# EAGLE design Motor_Driver_Mike (EAGLE 7.2.0)
DATABASE: C:\EAGLE-7.2.0\ulp\bom-ex164
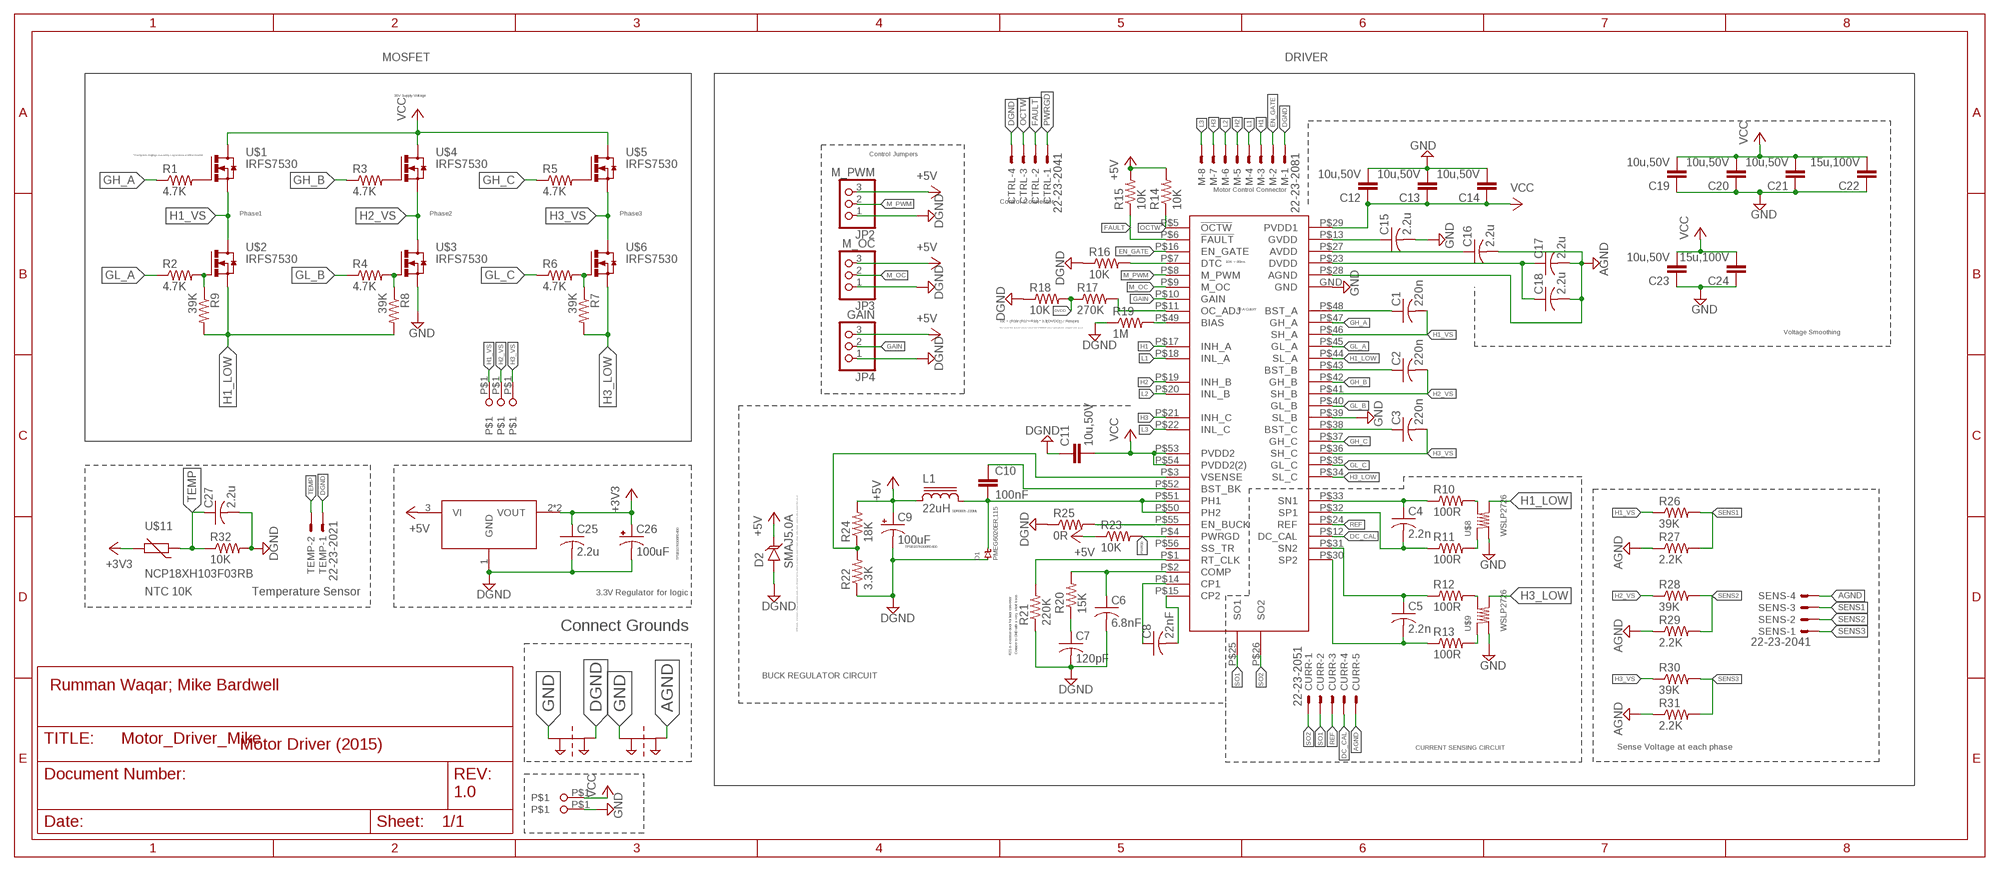
[diagram p0: schematic, sheet 1]

## Parts
C1  220n  C-USC0805  [C0805]
C2  220n  C-USC0805  [C0805]
C3  220n  C-USC0805  [C0805]
C4  2.2n  C-USC0603  [C0603]
C5  2.2n  C-USC0603  [C0603]
C6  6.8nF  C-USC0603  [C0603]
C7  120pF  C-USC0603  [C0603]
C8  22nF  C-USC0603  [C0603]
C9  100uF  CAP_POL3528-KIT  [EIA3528-KIT]
C10  100nF  CAP0805  [0805]
C11  10u,50V  CAP1206  [1206]
C12  10u,50V  CAP1206  [1206]
C13  10u,50V  CAP1206  [1206]
C14  10u,50V  CAP1206  [1206]
C15  2.2u  C-USC0805  [C0805]
C16  2.2u  C-USC0805  [C0805]
C17  2.2u  C-USC0805  [C0805]
C18  2.2u  C-USC0805  [C0805]
C19  10u,50V  CAP1206  [1206]
C20  10u,50V  CAP1206  [1206]
C21  10u,50V  CAP1206  [1206]
C22  15u,100V  C-EUC2220K  [C2220K]
C23  10u,50V  CAP1206  [1206]
C24  15u,100V  C-EUC2220K  [C2220K]
C25  2.2u  C-USC0805  [C0805]
C26  100uF  CAP_POL3528-KIT  [EIA3528-KIT]
C27  2.2u  C-USC0805  [C0805]
CTRL  22-23-2041  [22-23-2041]
CURR  22-23-2051  [22-23-2051]
D1  PMEG6020ER,115  DIODE[SCHOTKY]-SOD123W  [SOD123W]
D2  SMAJ5.0A  TVSSMA  [SMA-DIODE]
JP2  M_PWM  PINHD-1X3  [1X03]
JP3  M_OC  PINHD-1X3  [1X03]
JP4  GAIN  PINHD-1X3  [1X03]
L1  22uH  SDR0805  [SDR0805]
M  22-23-2081  [22-23-2081]
PT1  2PT_GND_TIE  [2PT_GND_TIE]
PT2  2PT_GND_TIE  [2PT_GND_TIE]
R1  4.7K  R-US_R0603  [R0603]
R2  4.7K  R-US_R0603  [R0603]
R3  4.7K  R-US_R0603  [R0603]
R4  4.7K  R-US_R0603  [R0603]
R5  4.7K  R-US_R0603  [R0603]
R6  4.7K  R-US_R0603  [R0603]
R7  39K  R-US_R0603  [R0603]
R8  39K  R-US_R0603  [R0603]
R9  39K  R-US_R0603  [R0603]
R10  100R  R-US_R0603  [R0603]
R11  100R  R-US_R0603  [R0603]
R12  100R  R-US_R0603  [R0603]
R13  100R  R-US_R0603  [R0603]
R14  10K  R-US_R0603  [R0603]
R15  10K  R-US_R0603  [R0603]
R16  10K  R-US_R0603  [R0603]
R17  270K  R-US_R0603  [R0603]
R18  10K  R-US_R0603  [R0603]
R19  1M  R-US_R0603  [R0603]
R20  15K  R-US_R0603  [R0603]
R21  220K  R-US_R0603  [R0603]
R22  3.3K  R-US_R0603  [R0603]
R23  10K  R-US_R0603  [R0603]
R24  18K  R-US_R0603  [R0603]
R25  0R  R-US_R0603  [R0603]
R26  39K  R-US_R0805  [R0805]
R27  2.2K  R-US_R0805  [R0805]
R28  39K  R-US_R0805  [R0805]
R29  2.2K  R-US_R0805  [R0805]
R30  39K  R-US_R0805  [R0805]
R31  2.2K  R-US_R0805  [R0805]
R32  10K  R-US_M0805  [M0805]
SENS  22-23-2041  [22-23-2041]
TEMP  22-23-2021  [22-23-2021]
U$1  IRFS7530  IRFS7530_HEATSINK  [IRF7530_HEATSINK]
U$2  IRFS7530  IRFS7530_HEATSINK  [IRF7530_HEATSINK]
U$3  IRFS7530  IRFS7530_HEATSINK  [IRF7530_HEATSINK]
U$4  IRFS7530  IRFS7530_HEATSINK  [IRF7530_HEATSINK]
U$5  IRFS7530  IRFS7530_HEATSINK  [IRF7530_HEATSINK]
U$6  IRFS7530  IRFS7530_HEATSINK  [IRF7530_HEATSINK]
U$7  DRV8302  [DRV8302]
U$8  WSLP2726  [WSLP2726]
U$9  WSLP2726  [WSLP2726]
U$10  TC2117  [SOT223]
U$11  NCP18XH103F03RB  [R0603]
U$12  1CONN_SOLDER  [1CONN_PAD]
U$13  1CONN_SOLDER  [1CONN_PAD]
U$14  1CONN_SOLDER  [1CONN_PAD]
U$15  1CONN_SOLDER  [1CONN_PAD]
U$16  1CONN_SOLDER  [1CONN_PAD]

## Nets
+3V3: C25.1 C26.A(+) U$10.2(VOUT) U$10.4(VOUT) U$11.2
+5V: C9.A(+) D2.C JP2.3 JP3.3 JP4.3 L1.1 R14.2 R15.2 R23.1 R24.2 U$10.3(VI)
AGND: C16.2 C17.2 C18.2 CURR.5 PT2.P$2 R27.1 R29.1 R31.1 SENS.4 U$7.P$28(AGND)
DC_CAL: CURR.4 U$7.P$12(DC_CAL)
DGND: C6.2 C7.2 C9.C(-) C11.1 C25.2 C26.C(-) C27.2 CTRL.4 D1.P$1 D2.A JP2.1 JP3.1 JP4.1 M.1 PT1.P$2 R16.1 R18.1 R19.1 R21.1 R22.1 R25.1 R32.2 TEMP.1 U$10.1(GND)
DVDD: R17.1 R18.2
EN_GATE: M.2 U$7.P$16(EN_GATE)
FAULT: CTRL.2 R15.1 U$7.P$6(!FAULT)
GAIN: JP4.2 U$7.P$10(GAIN)
GH_A: R1.1 U$7.P$47(GH_A)
GH_B: R3.1 U$7.P$42(GH_B)
GH_C: R5.1 U$7.P$37(GH_C)
GL_A: R2.1 U$7.P$45(GL_A)
GL_B: R4.1 U$7.P$40(GL_B)
GL_C: R6.1 U$7.P$35(GL_C)
GND: C12.2 C13.2 C14.2 C15.2 C19.1 C20.1 C21.1 C22.1 C23.1 C24.1 PT1.P$1 PT2.P$1 U$3.S1(S) U$3.S2(S) U$3.S3(S) U$3.S4(S) U$3.S5(S) U$7.GND U$7.P$39(SL_B) U$8.P$2 U$9.P$2 U$16.P$1
H1: M.3 U$7.P$17(INH_A)
H1_LOW: R8.2 R9.2 U$2.S1(S) U$2.S2(S) U$2.S3(S) U$2.S4(S) U$2.S5(S) U$7.P$44(SL_A) U$8.P$1
H1_VS: C1.2 R26.1 U$1.S1(S) U$1.S2(S) U$1.S3(S) U$1.S4(S) U$1.S5(S) U$2.D1(D) U$7.P$46(SH_A) U$14.P$1
H2: M.5 U$7.P$19(INH_B)
H2_VS: C2.2 R28.1 U$3.D1(D) U$4.S1(S) U$4.S2(S) U$4.S3(S) U$4.S4(S) U$4.S5(S) U$7.P$41(SH_B) U$13.P$1
H3: M.7 U$7.P$21(INH_C)
H3_LOW: R7.2 U$6.S1(S) U$6.S2(S) U$6.S3(S) U$6.S4(S) U$6.S5(S) U$7.P$34(SL_C) U$9.P$1
H3_VS: C3.2 R30.1 U$5.S1(S) U$5.S2(S) U$5.S3(S) U$5.S4(S) U$5.S5(S) U$6.D1(D) U$7.P$36(SH_C) U$12.P$1
L1: M.4 U$7.P$18(INL_A)
L2: M.6 U$7.P$20(INL_B)
L3: M.8 U$7.P$22(INL_C)
M_OC: JP3.2 U$7.P$9(M_OC)
M_PWM: JP2.2 U$7.P$8(M_PWM)
N$1: R1.2 U$1.G1(G)
N$2: R2.2 R9.1 U$2.G1(G)
N$3: R4.2 R8.1 U$3.G1(G)
N$4: R3.2 U$4.G1(G)
N$5: R5.2 U$5.G1(G)
N$6: R6.2 R7.1 U$6.G1(G)
N$7: C1.1 U$7.P$48(BST_A)
N$8: R17.2 U$7.P$11(OC_ADJ)
N$10: C8.1 U$7.P$14(CP1)
N$11: C5.2 R13.1 U$7.P$30(SP2)
N$12: C2.1 U$7.P$43(BST_B)
N$13: C8.2 U$7.P$15(CP2)
N$14: C7.1 R20.1
N$15: R21.2 U$7.P$1(RT_CLK)
N$16: R16.2 U$7.P$7(DTC)
N$17: R25.2 U$7.P$55(EN_BUCK)
N$18: C15.1 U$7.P$13(GVDD)
N$19: C10.2 D1.P$2 L1.2 U$7.P$50(PH2) U$7.P$51(PH1)
N$20: C6.1 R20.2 U$7.P$2(COMP)
N$21: R19.2 U$7.P$49(BIAS)
N$22: C4.1 R10.1 U$7.P$33(SN1)
N$23: C4.2 R11.1 U$7.P$32(SP1)
N$24: C5.1 R12.1 U$7.P$31(SN2)
N$26: C3.1 U$7.P$38(BST_C)
N$27: C16.1 U$7.P$27(AVDD)
N$28: R22.2 R24.1 U$7.P$3(VSENSE)
N$29: C10.1 U$7.P$52(BST_BK)
N$30: C17.1 C18.1 U$7.P$23(DVDD)
N$124: R12.2 U$9.P$3
N$126: R10.2 U$8.P$3
N$127: R11.2 U$8.P$4
N$128: R13.2 U$9.P$4
OCTW: CTRL.3 R14.1 U$7.P$5(!OCTW)
PWRGD: CTRL.1 R23.2 U$7.P$4(PWRGD)
REF: CURR.3 U$7.P$24(REF)
SENS1: R26.2 R27.2 SENS.3
SENS2: R28.2 R29.2 SENS.2
SENS3: R30.2 R31.2 SENS.1
SO1: CURR.2 U$7.P$25(SO1)
SO2: CURR.1 U$7.P$26(SO2)
TEMP: C27.1 R32.1 TEMP.2 U$11.1
VCC: C11.2 C12.1 C13.1 C14.1 C19.2 C20.2 C21.2 C22.2 C23.2 C24.2 U$1.D1(D) U$4.D1(D) U$5.D1(D) U$7.P$29(PVDD1) U$7.P$53(PVDD2) U$7.P$54(PVDD2(2)) U$15.P$1
Unconnected: U$7.P$56(SS_TR)

## Notes on the sheet
- MOSFET | DRIVER
- 36V Supply Voltage
- * Dampens ringing caused by capacitance of the mosfet | Control Jumpers
- Motor Control Connector
- Control Connector
- Phase1 | Phase2 | Phase3
- 10K = 80ns
- 90 A Cutoff
- Ioc = (R18/ (R17+R18) * 3.3[DVDD] ) / Rds(on)
- Don't mount R18, because internal current limit of DRV8302 doesn't work with this config for some reason
- Voltage Smoothing
- SDR0805-220ML
- TPSB107K006R0400
- TPSB107K006R0400
- NTC 10K | Temperature Sensor | 3.3V Regulator for logic
- Connect Grounds | A TVS diode, or transient voltage suppression diode, is an electrical device which is designed to divert or shunt voltage spikes from a circuit in order to protect that circuit.
- R21 is external clock for buck converter. | Connect to GND with a very short trace.
- BUCK REGULATOR CIRCUIT
- Rumman Waqar; Mike Bardwell
- Motor Driver (2015) | CURRENT SENSING CIRCUIT | Sense Voltage at each phase
- 1.0

## Library data of the parts
C1-C8 C15-C18 C25 C27 = adafruit:C-US: CAPACITOR, American symbol
C9 C26 = SparkFun-Capacitors:CAP_POL: Capacitor Polarized These are standard SMD and PTH capacitors. Normally 10uF, 47uF, and 100uF in electrolytic and tantalum varieties. Always verify the external diameter of the through hole cap, it varies with capacity, voltage, and manufacturer. The EIA devices should be standard.
C10-C14 C19-C21 C23 = SparkFun-Passives:CAP: Capacitor Standard 0603 ceramic capacitor, and 0.1" leaded capacitor.
C22 C24 = resistor:C-EU: CAPACITOR, European symbol
CTRL SENS = con-molex:22-23-2041: .100" (2.54mm) Center Header - 4 Pin; MF: MOLEX; MPN: 22-23-2041; OC_FARNELL: 1462920; OC_NEWARK: 38C0355
CURR = con-molex:22-23-2051: .100" (2.54mm) Center Header - 5 Pin; MF: MOLEX; MPN: 22-23-2051; OC_FARNELL: 1462952; OC_NEWARK: 38C9178
D1 = nxp:DIODE[SCHOTKY]
D2 = SparkFun-DiscreteSemi:TVS: Transient voltage suppressor- prevents ESD on inputs.
JP2-JP4 = pinhead:PINHD-1X3: PIN HEADER
L1 = bourne:SDR0805: POWER INDUCTOR
M = con-molex:22-23-2081: .100" (2.54mm) Center Header - 8 Pin; MF: MOLEX; MPN: 22-23-2081; OC_FARNELL: 1756826; OC_NEWARK: 01C7592
PT1 PT2 = SparkFun-Passives:2PT_GND_TIE: Package for connecting two ground nets in one place.
R1-R32 = adafruit:R-US_: RESISTOR, American symbol
TEMP = con-molex:22-23-2021: .100" (2.54mm) Center Header - 2 Pin; MF: MOLEX; MPN: 22-23-2021; OC_FARNELL: 1462926; OC_NEWARK: 25C3832
U$1-U$6 = bldc_lib:IRFS7530_HEATSINK: IRFS7530 with Heatsink
U$7 = bldc_lib:DRV8302: DRV8302 3-Phase Brushless Motor Pre-Driver with Dual Current Sense Amps and Buck Converter (PWM Ctrl)
U$8 U$9 = bldc_lib:WSLP2726: WSLP2726 Power Metal Strip® Resistors, Very High Power (to 7 W), Low Value (down to 0.0003 ), Surface Mount
U$10 = bldc_lib:TC2117
U$11 = bldc_lib:NCP18XH103F03RB: NTC Thermistor NTC Thermistors 10K OHM 1%
U$12-U$16 = bldc_lib:1CONN_SOLDER

## Board
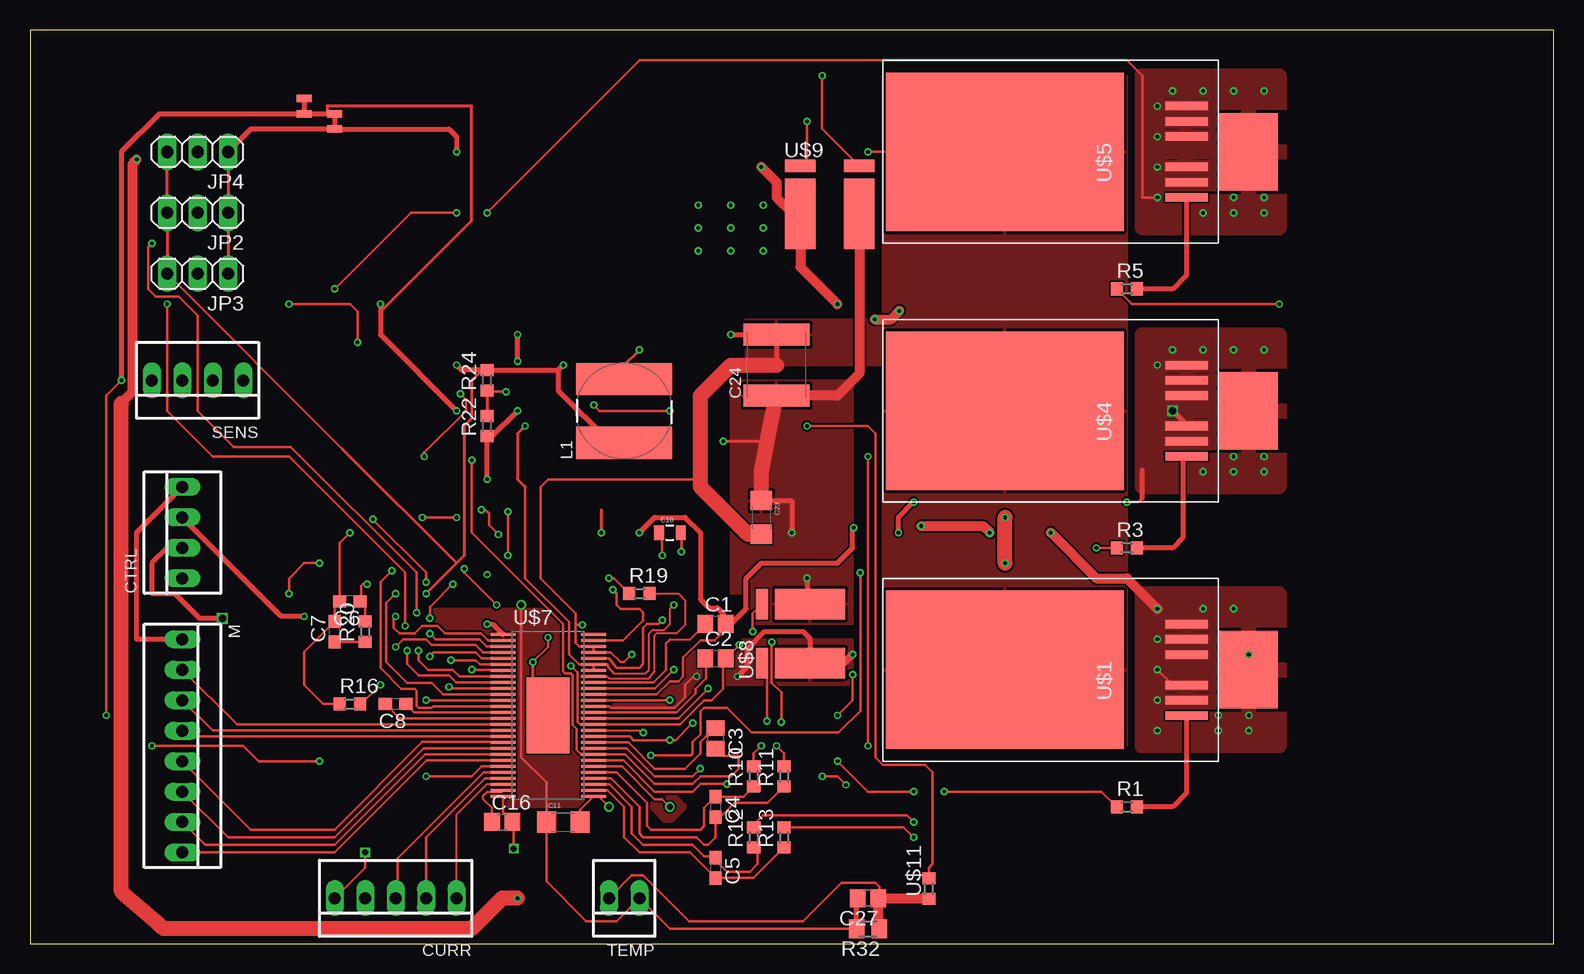
[diagram p1: board, top side]
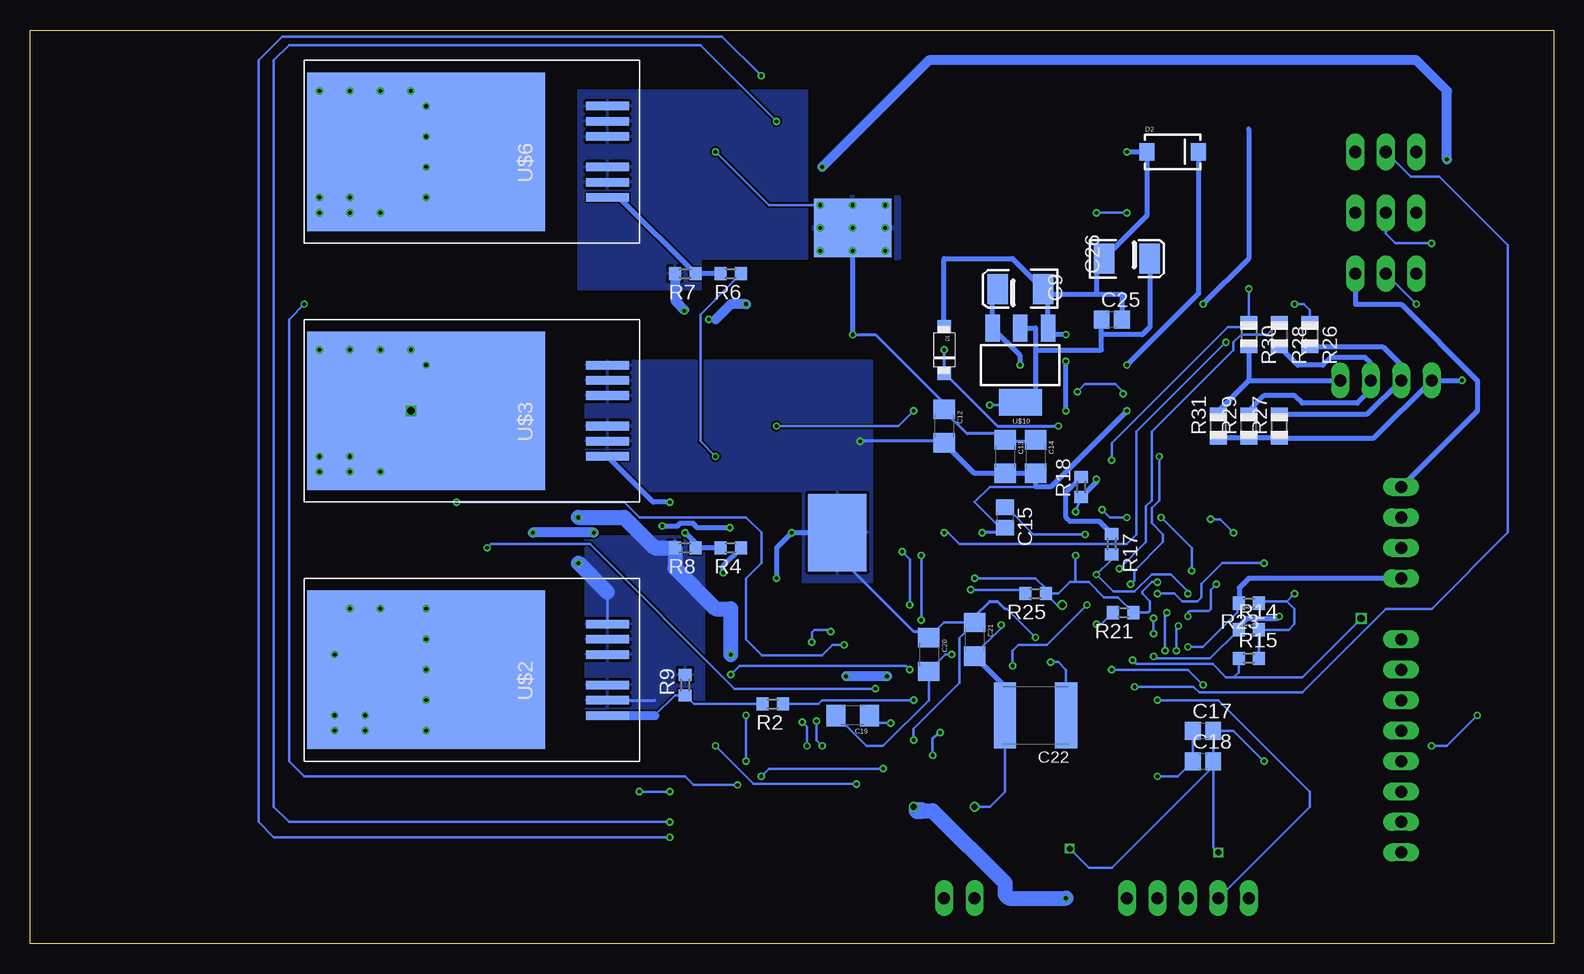
[diagram p2: board, bottom side, seen from below]

Size 127 x 76.2 mm. Coordinates in mm from the lower left corner, seen from the top.
Outline: 0,0 127,0 127,76.2 0,76.2 0,0
Copper layers (1*16): Top 0.035mm / dielectric 1.5mm / Bottom 0.035mm
Design rules "SeeedStudio_2layer_DRU_no_angle_20140221": minimum track width 6mil, minimum drill 12mil, track to track 6mil, track to pad 6mil, pad to pad 6mil, via to via 6mil, smd to smd 0mil, copper to edge 10mil, drill to drill 10mil, minimum pad ring 10mil, minimum via ring 6mil, stop-mask expansion 2mil, vias tented up to drill 100mil, thermal gap 10mil

### Footprints (pad centres in the part's own frame; a part is rotated, then mirrored left to right if it is on the bottom)
C0805 = smd 1.3 x 1.5: 1 -0.85,0; 2 0.85,0
C0603 = smd 1.1 x 1: 1 -0.85,0; 2 0.85,0
EIA3528-KIT = smd 1.7 x 2.5: A 1.9,0; C -1.9,0
0805 = smd 0.8 x 1.2: 1 -0.9,0; 2 0.9,0
1206 = smd 1.6 x 1.8: 1 -1.4,0; 2 1.4,0
C2220K = smd 1.85 x 5.5: 1 -2.55,0; 2 2.55,0
22-23-2041 = drill 1 long: 1 -3.81,0; 2 -1.27,0; 3 1.27,0; 4 3.81,0
22-23-2051 = drill 1 long: 1 -5.08,0; 2 -2.54,0; 3 0,0; 4 2.54,0; 5 5.08,0
SOD123W = smd 1.1 x 1.1: P$1 -1.95,0; P$2 1.95,0
SMA-DIODE = smd 1.27 x 1.47: A -2.15,0; C 2.15,0
1X03 = drill 1.016 long: 1 -2.54,0; 2 0,0; 3 2.54,0
SDR0805 = smd 2.7 x 8: 1 -2.65,0; 2 2.65,0
22-23-2081 = drill 1 long: 1 -8.89,0; 2 -6.35,0; 3 -3.81,0; 4 -1.27,0; 5 1.27,0; 6 3.81,0; 7 6.35,0; 8 8.89,0
2PT_GND_TIE = smd 1.27 x 0.635: P$1 0,0.635; P$2 0,-0.635
R0603 = smd 1 x 1.1: 1 -0.85,0; 2 0.85,0
R0805 = smd 1.1 x 1.4: 1 -1,0; 2 1,0
M0805 = smd 1.3 x 1.6: 1 -0.95,0; 2 0.95,0
22-23-2021 = drill 1 long: 1 -1.27,0; 2 1.27,0
IRF7530_HEATSINK = smd 13.208 x 19.812: D1 0,1.27 | smd 0.711 x 3.556: G1 -3.81,-13.856; S1 -2.54,-13.856; S2 -1.27,-13.856; S3 1.27,-13.856; S4 2.54,-13.856; S5 3.81,-13.856
DRV8302 = smd 3.61 x 6.35: GND 0,0 | smd 2.1 x 0.27: P$1 -3.75,6.75; P$2 -3.75,6.25; P$3 -3.75,5.75; P$4 -3.75,5.25; P$5 -3.75,4.75; P$6 -3.75,4.25; P$7 -3.75,3.75; P$8 -3.75,3.25; P$9 -3.75,2.75; P$10 -3.75,2.25; P$11 -3.75,1.75; P$12 -3.75,1.25; P$13 -3.75,0.75; P$14 -3.75,0.25; P$15 -3.75,-0.25; P$16 -3.75,-0.75; P$17 -3.75,-1.25; P$18 -3.75,-1.75; P$19 -3.75,-2.25; P$20 -3.75,-2.75; P$21 -3.75,-3.25; P$22 -3.75,-3.75; P$23 -3.75,-4.25; P$24 -3.75,-4.75; P$25 -3.75,-5.25; P$26 -3.75,-5.75; P$27 -3.75,-6.25; P$28 -3.75,-6.75; P$29 3.8,-6.75; P$30 3.8,-6.25; P$31 3.8,-5.75; P$32 3.8,-5.25; P$33 3.8,-4.75; P$34 3.8,-4.25; P$35 3.8,-3.75; P$36 3.8,-3.25; P$37 3.8,-2.75; P$38 3.8,-2.25; P$39 3.8,-1.75; P$40 3.8,-1.25; P$41 3.8,-0.75; P$42 3.8,-0.25; P$43 3.8,0.25; P$44 3.8,0.75; P$45 3.8,1.25; P$46 3.8,1.75; P$47 3.8,2.25; P$48 3.8,2.75; P$49 3.8,3.25; P$50 3.8,3.75; P$51 3.8,4.25; P$52 3.8,4.75; P$53 3.8,5.25; P$54 3.8,5.75; P$55 3.8,6.25; P$56 3.8,6.75
WSLP2726 = smd 2.54 x 5.842: P$1 -2.464,-0.889; P$2 2.464,-0.889 | smd 2.54 x 1.016: P$3 -2.464,3.111; P$4 2.464,3.111
SOT223 = smd 1.219 x 2.235: 1 -2.311,-3.099; 2 0,-3.099; 3 2.311,-3.099 | smd 3.6 x 2.2: 4 0,3.099
1CONN_PAD = smd 6.452 x 4.877: P$1 0,0

### Placement (x,y rotation side)
C1  57.15,26.67 0 top
C2  57.15,23.81 0 top
C3  57.15,17.14 270 top
C4  57.15,11.43 270 top
C5  57.15,6.35 270 top
C6  26.67,28.57 180 top
C7  25.4,26.04 90 top
C8  30.48,20 180 top
C9  44.45,54.61 180 bottom
C10  53.34,34.29 0 top
C11  44.45,10.16 0 top
C12  50.8,43.18 270 bottom
C13  45.72,40.64 270 bottom
C14  43.18,40.64 270 bottom
C15  45.72,35.56 270 bottom
C16  39.37,10.16 0 top
C17  29.21,17.78 0 bottom
C18  29.21,15.24 0 bottom
C19  58.42,19.05 180 bottom
C20  52.07,24.13 270 bottom
C21  48.26,25.4 270 bottom
C22  43.18,19.05 180 bottom
C23  60.96,35.56 270 top
C24  62.23,48.26 90 top
C25  36.83,52.07 0 bottom
C26  35.56,57.15 0 bottom
C27  69.85,3.81 180 top
CTRL  12.7,34.29 90 top
CURR  30.48,3.81 180 top
D1  50.8,49.53 270 bottom
D2  31.75,66.04 0 bottom
JP2  13.97,60.96 180 top
JP3  13.97,55.88 180 top
JP4  13.97,66.04 180 top
L1  49.53,44.45 90 top
M  12.7,16.51 270 top
PT1  25.4,68.58 0 top
PT2  22.86,69.85 0 top
R1  91.44,11.43 0 top
R2  65.09,20 180 bottom
R3  91.44,33.02 0 top
R4  68.58,33.02 180 bottom
R5  91.44,54.61 0 top
R6  68.58,55.88 180 bottom
R7  72.39,55.88 180 bottom
R8  72.39,33.02 180 bottom
R9  72.39,21.59 90 bottom
R10  60.33,13.97 90 top
R11  62.87,13.97 90 top
R12  60.33,8.89 90 top
R13  62.87,8.89 90 top
R14  25.4,26.19 0 bottom
R15  25.4,23.81 0 bottom
R16  26.67,20 0 top
R17  36.83,33.34 270 bottom
R18  39.37,38.1 90 bottom
R19  50.8,29.21 0 top
R20  27.94,26.04 90 top
R21  35.88,27.62 180 bottom
R22  38.1,43.18 90 top
R23  25.4,28.42 180 bottom
R24  38.1,46.99 90 top
R25  43.18,29.21 180 bottom
R26  20.32,50.8 270 bottom
R27  22.86,43.18 90 bottom
R28  22.86,50.8 270 bottom
R29  25.4,43.18 90 bottom
R30  25.4,50.8 270 bottom
R31  27.94,43.18 90 bottom
R32  69.85,1.27 180 top
SENS  13.97,46.99 180 top
TEMP  49.53,3.81 180 top
U$1  82.55,22.86 90 top
U$2  92.71,22.86 90 bottom
U$3  92.71,44.45 90 bottom
U$4  82.55,44.45 90 top
U$5  82.55,66.04 90 top
U$6  92.71,66.04 90 bottom
U$7  43.18,19.05 0 top
U$8  64.14,25.88 90 top
U$9  66.67,61.75 0 top
U$10  44.45,48.26 180 bottom
U$11  74.93,4.6 90 top
U$12  101.6,66.04 90 top
U$13  101.6,44.45 90 top
U$14  101.6,22.86 90 top
U$15  58.42,59.69 0 bottom
U$16  59.69,34.29 270 bottom

### Tracks (layer width: path | path; a pad name or v marks a point on that pad's centre or on a via)
+3V3  (via drill 0.3 pad 0.3)
  Top 0.203: U$11.2 74.93,6.35 75.25,6.67 75.25,14.29 74.61,14.92 71.12,14.92 70.48,15.56 70.48,42.55 69.85,43.18 v64.77,43.18 | v53.34,44.45 47.47,44.45 v46.99,44.93
  Bottom 0.203: v64.77,43.18 54.61,43.18 v53.34,44.45 | v46.99,44.93 44.69,44.93 U$10.4
  Bottom 0.406: U$10.2 43.18,51.36 43.18,49.53 | 43.18,49.53 37.68,49.53 C25.1 37.68,50.8 34.29,50.8 33.66,51.43 C26.A | 43.74,44.45 44.09,44.81 | 44.09,44.81 U$10.4 | 43.18,49.53 43.18,45.72 44.09,44.81
+5V  (via drill 0.3, 0.3 pad 0.3)
  Top 0.203: 26.04,41.27 JP3.3 | v24.13,31.75 22.86,31.75 21.59,30.48 v21.59,29.21
  Top 0.254: JP3.3 JP2.3 JP4.3 | 35.56,31.75 36.2,32.38 36.2,43.18 36.83,43.81 36.83,46.99 38.1,48.26 R24.2 | 35.56,31.75 v33.02,29.21 | 26.04,41.27 35.56,31.75
  Top 0.406: v35.56,48.26 35.98,47.84 R24.2 44.03,47.84 | 44.03,47.84 v44.45,48.26 | 44.03,47.84 44.03,46.14 48.26,41.91 49.42,41.91 L1.1
  Bottom 0.203: R15.2 R14.2 22.07,26.19 21.59,26.67 21.59,27.94 22.23,28.57 | 22.23,28.57 24.39,28.57 R23.1 | v33.02,29.21 31.59,29.21 30.96,28.57 29.69,28.57 29.37,28.89 29.37,30 27.62,31.75 v24.13,31.75 | v21.59,29.21 22.23,28.57
  Bottom 0.406: C9.A 46.76,54.2 U$10.3 44.45,49.05 v44.45,48.26 | D2.C 29.6,54.22 v35.56,48.26
AGND  (via drill 0.3, 0.3 pad 0.3, 0.5)
  Top 0.203: U$7.P$28 39.43,10.95 C16.2 40.32,10.06 v40.32,7.94 | v27.94,7.62 27.94,6.35 CURR.5 | v24.13,15.24 19.05,15.24 17.78,16.51 v10.16,16.51 | v6.35,19.05 6.35,45.72 v7.62,46.99
  Top 0.406: v7.62,46.99 7.62,66.04 10.79,69.22 PT2.P$2
  Bottom 0.203: 28.36,14.82 C18.2 C17.2 26.67,17.78 v24.13,15.24 | 28.36,14.82 36.83,6.35 38.73,6.35 v40.32,7.94 | 28.36,14.82 28.36,8.04 v27.94,7.62 | v10.16,16.51 8.89,16.51 v6.35,19.05
  Bottom 0.406: R31.1 R29.1 R27.1 14.97,42.18 SENS.4 v7.62,46.99
DC_CAL  (via drill 0.3)
  Top 0.203: U$7.P$12 33.04,20.3 v33.02,20.32
  Bottom 0.203: v33.02,20.32 27.94,20.32 20.32,12.7 20.32,11.43 CURR.4
DGND  (via drill 0.3, 0.3 pad 0.3, 0.5)
  Top 0.203: R32.2 53.34,1.27 TEMP.1 48.9,1.91 46.35,1.91 43.05,5.21 C11.1 43.05,13.46 40.96,15.56 v40.96,28.26 | v39.85,32.38 v39.85,36.04 | R16.1 24.45,20 22.86,21.59 22.86,24.34 C7.2 25.4,28.16 C6.2 25.82,33.44 v26.67,34.29 | v33.02,30.16 33.02,30.96 v28.57,35.4 | v48.26,30.48 48.68,30.48 R19.1
  Top 0.254: JP4.1 JP2.1 JP3.1
  Top 0.406: JP4.1 18.41,67.94 PT1.P$2 34.92,67.94 35.56,67.31 v35.56,66.04 | M.1 8.89,25.4 8.89,34.29 CTRL.4 | v38.1,38.73 R22.1 38.52,42.33 v40.64,44.45 | v40.64,48.58 v40.64,50.8 | R32.2 68.9,3.71 C27.2
  Bottom 0.203: R25.1 41.27,29.21 40.32,30.16 39.85,30.16 | v40.96,28.26 41.38,28.26 R25.1 | v39.85,36.04 R18.1 | v39.85,32.38 39.85,30.16 | v33.02,30.16 33.5,30.16 34.29,29.37 34.29,29.21 33.66,28.57 33.66,27.78 33.81,27.62 R21.1 36.3,28.89 37.47,28.89 38.73,30.16 39.85,30.16 | v28.57,35.4 27.78,35.4 v26.67,34.29 | R25.1 42.33,29.63 43.18,30.48 v48.26,30.48
  Bottom 0.406: 42.14,54.2 U$10.1 41.58,50.8 v40.64,50.8 | 42.14,54.2 C9.C 45.09,57.15 50.8,57.15 D1.P$1 | 42.14,54.2 38.1,54.2 | 38.1,54.2 35.98,54.2 C25.2 | 38.1,54.2 38.1,57.15 C26.C 33.9,60.71 D2.A v35.56,66.04 | JP3.1 16.51,53.34 12.7,53.34 6.35,46.99 6.35,44.45 CTRL.4 | 39.37,37.47 R18.1 38.1,38.52 v38.1,38.73 | v40.64,44.45 v40.64,48.58
  pour Top: 29.21,27.94 48.26,27.94 48.26,11.43 29.21,11.43
DVDD
  Bottom 0.406: R18.2 40.64,37.68 40.64,35.56 40.32,35.24 37.88,35.24 R17.1
EN_GATE
  Top 0.203: U$7.P$16 17.26,18.3 M.2
FAULT  (via drill 0.3, 0.6)
  Top 0.203: U$7.P$6 37.5,23.3 37.15,23.65 v35.08,23.65
  Top 0.406: CTRL.2 11.43,33.02 10.16,31.75 10.16,29.21 12.06,29.21 14.13,27.15 v16.03,27.15
  Bottom 0.203: v16.03,27.15 20.95,22.23 26.67,22.23 | 26.67,22.23 27.3,22.23 28.42,23.34 34.77,23.34 v35.08,23.65 | R15.1 26.25,22.64 26.67,22.23
GAIN  (via drill 0.3)
  Top 0.203: U$7.P$10 35.06,21.3 v34.92,21.43
  Bottom 0.203: v34.92,21.43 30,21.43 29.53,20.95 20.95,20.95 13.97,27.94 10.16,27.94 3.81,34.29 3.81,58.26 9.53,63.98 11.91,63.98 JP4.2
GH_A  (via drill 0.3, 0.3 pad 0.3)
  Top 0.203: U$7.P$47 52.1,21.3 v53.66,22.86 | v68.58,22.46 68.58,20.32 v67.31,19.05 | v67.31,15.24 69.85,12.7 v73.66,12.7 | v76.2,12.7 89.32,12.7 R1.1
  Bottom 0.203: v67.31,19.05 v67.31,15.24 | v73.66,12.7 v76.2,12.7 | v53.66,22.86 53.98,23.18 67.87,23.18 v68.58,22.46
GH_B  (via drill 0.3)
  Top 0.203: U$7.P$42 54.04,18.8 v56.52,21.27 | v88.9,33.02 R3.1
  Bottom 0.203: v56.52,21.27 68.26,21.27 80.33,33.34 88.58,33.34 v88.9,33.02
GH_C  (via drill 0.3, 0.3 pad 0.3)
  Top 0.203: 90.81,54.4 R5.1 91.86,53.34 v104.14,53.34 | U$7.P$37 49.74,16.3 52.07,13.97 55.24,13.97 v55.88,14.61 | v66.04,13.97 67.31,13.97 v68.02,13.26
  Bottom 0.203: v55.88,14.61 65.41,14.61 v66.04,13.97 | v68.02,13.26 71.68,13.26 72.39,13.97 104.14,13.97 105.41,15.24 105.41,52.07 v104.14,53.34
GL_A  (via drill 0.3)
  Top 0.203: v53.34,20.32 47,20.32 U$7.P$45
  Bottom 0.203: R2.1 61.28,20 60.96,20.32 v53.34,20.32
GL_B  (via drill 0.3, 0.3 pad 0.3)
  Top 0.203: v51.12,17.62 51.12,17.78 U$7.P$40 | v51.75,15.72 55.09,15.72 55.24,15.88 55.24,16.83 55.88,17.46 55.88,19.37 56.2,19.68 58.1,19.68 60.17,17.62 67.39,17.62 69.22,19.45 v69.22,30.96
  Bottom 0.203: 67.94,32.8 R4.1 | v51.75,15.72 51.75,17.14 v51.12,17.62
  Bottom 0.406: v69.22,30.96 69.22,31.54 R4.1
GL_C  (via drill 0.3)
  Top 0.203: U$7.P$35 49.47,15.3 52.07,12.7 55.24,12.7 55.88,13.34 v58.1,13.34 | v69.85,16.51 v69.85,40.64
  Bottom 0.203: v58.1,13.34 66.67,13.34 v69.85,16.51 | R6.1 69.85,53.76 69.85,53.74 71.12,52.47 71.12,41.91 v69.85,40.64
GND  (via drill 0.3, 0.3 pad 0.3)
  Top 0.203: v55.24,18.41 53.82,16.99 v53.34,16.99 50.32,16.99 50.01,17.3 49.85,17.3 U$7.P$39 | v43.18,25.56 43.18,24.77 v41.91,23.5
  Top 0.254: U$7.GND 41.91,20.32 v41.91,23.5 | 24.77,69.22 24.77,69.85 36.83,69.85 36.83,60.33 29.21,52.7 | v47.62,34.29 47.62,36.2 | v57.78,41.91 60.96,41.91 61.45,41.81
  Top 0.406: 22.86,69.22 24.77,69.22 PT1.P$1 25.4,68.58 | v29.21,53.34 29.21,52.7 29.21,50.8 v35.56,44.45 | C23.1 63.5,36.96 v63.5,34.29 | v64.77,30.48 64.77,28.59 U$8.P$2
  Top 0.813: U$9.P$2 69.14,47.55 67.31,45.72 C24.1
  Top 1.27: C23.1 60.96,39.36 61.45,41.81 C24.1
  Bottom 0.203: C20.1 50.8,26.8 C21.1 49.53,25.53 49.53,21.75 53.34,17.94 v53.34,16.99 | v41.91,23.5 41.27,23.5 40.64,22.86 C22.1 | v55.24,18.41 56.38,18.41 C19.1 | 45.72,27.94 45.56,27.94 v43.18,25.56 | 43.18,38.1 46.99,38.1 48.26,36.83 46.14,34.71 C15.2
  Bottom 0.254: 61.59,34.29 53.34,26.04 52.07,26.04 C20.1 | 45.72,27.94 46.35,28.57 46.99,28.57 48.26,27.3 C21.1 | C22.1 | v47.62,34.29 45.72,34.29 C15.2 | v57.78,41.91 50.8,41.91 C12.2
  Bottom 0.406: C12.2 48.26,39.24 C13.2 C14.2 43.18,38.1 41.91,38.1 v35.56,44.45 | 25.4,67.94 25.4,57.15 v29.21,53.34 | U$16.P$1 61.59,34.29 v63.5,34.29 64.77,33.02 v64.77,30.48
  pour Bottom: 80.64,48.58 80.64,37.78 62.55,37.78 62.55,30.16 56.83,30.16 56.83,48.58
  pour Top: 59.69,26.67 59.69,29.21 58.42,29.21 58.42,46.99 68.58,46.99 68.58,26.67
H1
  Top 0.203: U$7.P$17 15.22,17.8 M.3
H1_LOW  (via drill 0.3 pad 0.3)
  Top 0.203: U$7.P$44 48.3,19.8 48.42,19.68 53.74,19.68 54.61,20.56 54.61,21.59 55.32,22.3 v55.56,22.3 | U$8.P$1 67.86,23.41
  Top 0.406: v58.98,22.3 59.77,23.1 59.77,24.61 61.2,26.04 64.45,26.04 65.01,25.48 65.01,23.43 U$8.P$1
  Top 0.635: 67.86,23.41 v68.58,24.13
  Top 1.27: v81.28,31.75 v81.28,35.56
  Bottom 0.203: U$2.S5 78.85,29.32 | 68.58,27.94 68.58,28.36
  Bottom 0.254: U$2.S1 74.93,20.32
  Bottom 0.813: v55.56,22.3 v58.98,22.3
  Bottom 1.27: 78.85,29.32 v81.28,31.75 | v81.28,35.56 77.47,35.56 74.93,33.02 R8.2 73.24,31.33 69.85,27.94 68.58,27.94 v68.58,24.13
  pour Bottom: 70.8,33.97 80.64,33.97 80.64,18.73 70.8,18.73
  pour Top: 68.58,25.4 52.07,25.4 48.66,20.4 48.66,17.86 53.34,17.78 57.15,21.59 68.58,21.59
H1_VS  (via drill 0.3, 0.3 pad 0.3)
  Top 0.203: U$7.P$46 52.23,20.8 53.34,21.91 54.05,21.91 54.45,22.3 54.45,23.89 55.88,25.32 57.07,25.32 57.47,25.72 57.47,26.14 C1.2 58.42,26.67 | U$1.S2 95.25,21.59 U$2.D1 | v27.3,50.16 27.3,52.7 26.67,53.34 v21.59,53.34 | 68.58,34.61 v68.66,34.69
  Top 0.406: v50.8,34.29 52.07,35.56 54.61,35.56 55.88,34.29 55.88,28.73 56.59,28.02 57.31,28.02 57.78,27.54 57.78,26.89 C1.2 | 58.42,26.67 59.69,27.94 59.69,30.48 60.96,31.75 67.31,31.75 68.58,33.02 68.58,34.61
  Top 0.813: v85.09,34.29 88.9,30.48 91.44,30.48 v93.98,27.94 | v74.3,34.85 79.45,34.85 v80.01,34.29
  Bottom 0.203: v27.3,50.16 34.77,42.7 34.77,34.13 35.56,33.34 49.53,33.34 50.48,34.29 v50.8,34.29 | v21.59,53.34 20.8,53.34 20.32,52.86 R26.1
  Bottom 0.254: 20.32,51.44 R26.1
  Bottom 0.406: v68.66,34.69 71.36,34.69 71.75,35.08 72.79,35.08 73.03,34.85 v74.3,34.85
  Bottom 0.813: v80.01,34.29 v85.09,34.29
  other vias: 97.79,27.94 100.33,27.94 101.6,24.13 93.98,25.4 93.98,22.86 93.98,20.32 93.98,17.78 99.06,19.05 99.06,17.78 101.6,17.78 101.6,19.05
  pour Top: 92.71,29.21 104.14,29.21 104.14,16.51 92.71,16.51
H2
  Top 0.203: U$7.P$19 39.4,16.83 32.7,16.83 25.4,9.53 18.41,9.53 M.5
H2_VS  (via drill 0.3, 0.3 pad 0.3, 0.6)
  Top 0.203: v36.2,31.27 36.2,30.96 v38.89,28.26 | v45.09,23.18 45.64,22.62 45.64,18.49 45.84,18.3 U$7.P$41 54.18,18.3 56.2,20.32 56.83,20.32 57.78,21.27 57.78,23.6 C2.2 58.02,23.81 v59.13,24.92 | v91.44,36.83 92.39,36.83 92.71,37.15
  Top 0.406: 92.71,37.15 92.71,39.48 | U$4.S2 96.41,43.29 v95.25,44.45
  Bottom 0.203: v38.89,28.26 42.23,24.92 44.61,24.92 45.09,24.45 v45.09,23.18 | R28.1 23.86,50.8 26.04,50.8 26.67,50.16 26.67,49.53 33.5,42.7 33.5,36.99 33.97,36.51 33.97,33.5 v36.2,31.27 | v59.13,24.92 60.09,24.92 60.96,24.05 65.96,24.05 67.31,25.4 67.31,30.48 66.04,31.75 66.04,34.29 67.31,35.56 76.2,35.56 77.47,36.83 v91.44,36.83
  Bottom 0.406: v95.25,44.45 U$3.D1
  other vias: 102.87,49.53 100.33,49.53 97.79,49.53 95.25,49.53 93.98,48.26 97.79,39.37 100.33,39.37 100.33,40.64 102.87,40.64 102.87,39.37
  pour Top: 92.71,50.8 104.14,50.8 104.14,38.1 92.71,38.1
H3
  Top 0.203: U$7.P$21 32.95,15.8 25.4,8.26 14.61,8.26 M.7
H3_LOW  (via drill 0.3, 0.3 pad 0.3, 0.5)
  Top 0.203: U$7.P$34 49.34,14.8 52.07,12.06 52.7,12.06 v53.34,11.43 | 63.5,60.96 64.12,60.96 U$9.P$1
  Top 0.813: v60.96,64.77 62.23,63.5 62.23,62.23 63.5,60.96 | U$9.P$1 64.21,56.44 v67.31,53.34 | v70.41,52.07 71.75,52.07 v72.47,52.78 | 7.62,45.09 8.57,46.04 8.57,65.09 v8.89,65.41
  Top 1.27: 7.62,45.09 7.62,4.37 10.48,1.91 11.11,1.27 36.83,1.27 39.37,3.81 v40.64,3.81
  Bottom 0.203: 53.02,11.11 v53.34,11.43 | 69.85,52.07 v70.41,52.07 | v72.47,52.78 72.47,52.86 | 73.18,55.82 R7.2
  Bottom 0.254: 78.74,69.85 U$6.S5
  Bottom 0.813: v8.89,65.41 8.89,71.12 11.43,73.66 52.07,73.66 v60.96,64.77 | v67.31,53.34 68.58,53.34 69.85,52.07 | 72.47,52.86 73.18,53.58 73.18,55.82
  Bottom 1.27: v40.64,3.81 45.4,3.81 45.72,4.13 45.72,5.08 51.75,11.11 52.7,11.11
  Bottom 1.397: 52.7,11.11 53.02,11.11
  pour Bottom: 77.15,70.48 80.96,70.48 80.96,63.18 77.15,63.18
  pour Bottom: 81.28,71.12 62.23,71.12 62.23,57.15 71.12,57.15 71.12,54.61 81.28,54.61
H3_VS  (via drill 0.3, 0.3 pad 0.3)
  Top 0.152: U$7.P$36 45.95,15.8 45.56,16.19
  Top 0.203: U$7.P$36 49.6,15.8 52.07,13.34 55.24,13.34 55.88,13.97 58.42,13.97 59.05,14.61 59.05,15.66 57.78,15.66 C3.2 | v36.83,40.32 36.83,34.29 44.45,26.67 44.45,22.7 44.61,22.54 45.09,22.54 45.24,22.38 45.24,18.26 45.56,17.94 45.56,16.19 | v93.98,62.23 92.71,62.23 92.71,72.39 91.44,73.66 50.8,73.66 v38.1,60.96 | v35.56,60.96 31.75,60.96 v25.4,54.61
  Bottom 0.203: v36.83,40.32 36.83,41.75 27.15,51.44 25.77,51.44 R30.1 v25.4,54.61 | v38.1,60.96 v35.56,60.96
  Bottom 0.406: v93.98,64.77 U$6.D1
  other vias: 102.87,71.12 100.33,71.12 97.79,71.12 95.25,71.12 93.98,69.85 93.98,67.31 97.79,60.96 100.33,60.96 100.33,62.23 102.87,60.96 102.87,62.23
  pour Top: 92.71,72.39 104.14,72.39 104.14,59.69 92.71,59.69
L1
  Top 0.203: U$7.P$18 13.18,17.3 M.4
L2
  Top 0.203: U$7.P$20 32.81,16.3 25.4,8.89 16.51,8.89 M.6
L3
  Top 0.203: U$7.P$22 33.08,15.3 25.4,7.62 M.8
M_OC  (via drill 0.3, 0.3 pad 0.3)
  Top 0.203: U$7.P$9 35.51,21.8 34.92,22.38 32.38,22.38 31.43,23.34 v31.43,24.45 | v31.27,26.51 31.27,30.96 21.59,40.64 15.24,40.64 11.43,44.45 v11.43,53.34
  Bottom 0.203: v31.43,24.45 31.43,26.35 v31.27,26.51 | v11.43,53.34 JP3.2
M_PWM  (via drill 0.3, 0.3 pad 0.3)
  Top 0.203: U$7.P$8 35.8,22.3 35.24,22.86 33.18,22.86 32.38,23.65 v32.38,24.45 | v32.23,27.62 32.23,30.96 21.75,41.43 16.99,41.43 13.97,44.45 13.97,52.39 12.38,53.98 10.48,53.98 9.84,54.61 9.84,58.1 v10.16,58.42
  Bottom 0.203: v32.38,24.45 32.38,27.46 v32.23,27.62 | v10.16,58.42 13.18,58.42 13.97,59.21 JP2.2
N$1
  Top 0.203: 92.6,11.74 R1.2
  Top 0.406: U$1.G1 96.41,12.59 95.25,11.43 R1.2
N$2
  Bottom 0.203: 74.93,19.05 73.24,20.74 R9.1 71.65,20 R2.2
  Bottom 0.762: U$2.G1 74.93,19.05
N$3  (via drill 0.3 pad 0.3)
  Top 0.406: v72.39,34.29 72.39,35.56 v73.66,36.83
  Bottom 0.254: 71.12,33.02 R8.1
  Bottom 0.406: R4.2 71.12,33.02 | R8.1 71.54,33.44 v72.39,34.29 | v73.66,36.83 75.04,36.83 U$3.G1
N$4
  Top 0.406: U$4.G1 96.1,40.33 96.1,33.87 95.25,33.02 R3.2
N$5
  Top 0.406: 92.6,54.92 R5.2 95.25,54.61 96.41,55.77 U$5.G1
N$6
  Bottom 0.254: 71.12,55.88 R7.1
  Bottom 0.406: R6.2 71.12,55.88 | U$6.G1 77.89,62.23 R7.1
N$7
  Top 0.152: 53.02,24.66 53.02,25.08 53.34,25.4 55.03,25.4 C1.1
  Top 0.203: U$7.P$48 51.96,21.8 53.02,22.86 53.02,24.66
N$8  (via drill 0.3, 0.3 pad 0.3)
  Top 0.203: U$7.P$11 34.45,20.8 33.5,21.75 31.43,21.75 29.69,23.5 29.69,28.42 v30.48,29.21
  Bottom 0.203: v30.48,29.21 30.48,29.37 31.91,30.8 33.5,30.8 34.92,29.37 36.67,29.37 v38.1,30.8 | 37.94,30.64 v38.1,30.8 | v38.1,30.8 38.1,30.9 | R17.2 36.83,32.07 v38.1,30.8
N$9
  pour Top: 54.61,11.43 50.8,15.24 49.05,15.24 49.05,14.29 52.86,10.32 53.5,10.32
N$10
  Top 0.203: U$7.P$14 32.03,19.3 C8.1
N$11
  Top 0.203: U$7.P$30 48.16,12.8 49.53,11.43 49.53,8.89 50.8,7.62 55.03,7.62 C5.2 60.33,5.5 R13.1
N$12
  Top 0.203: U$7.P$43 53.91,19.3 55.48,20.88 55.48,21.27 56.36,22.15 56.36,23.76 C2.1
N$13
  Top 0.203: U$7.P$15 30.83,18.8 C8.2
N$14
  Top 0.203: R20.1 C7.1
N$15  (via drill 0.3)
  Top 0.406: v38.1,26.67 38.56,26.67 U$7.P$1
  Bottom 0.203: v38.1,26.67 37.68,26.67 R21.2
N$16  (via drill 0.3 pad 0.3)
  Top 0.203: R16.2 27.62,20 v29.21,21.59 | 39.33,22.7 U$7.P$7 39.37,22.86 v36.83,22.86
  Bottom 0.203: v29.21,21.59 30.48,22.86 v36.83,22.86
N$17  (via drill 0.3)
  Top 0.203: U$7.P$55 49.43,25.3 51.12,26.99 51.12,27.62 50.8,27.94 49.21,27.94 48.9,28.26 48.9,29.21 v48.58,29.53
  Bottom 0.203: v48.58,29.53 44.35,29.53 R25.2
N$18  (via drill 0.3, 0.3 pad 0.3)
  Top 0.203: U$7.P$13 33.61,19.8 33.5,19.68 32.38,19.68 32.23,19.84 32.23,21.11 32.07,21.27 30.96,21.27 29.21,23.02 29.21,30.16 v30.16,31.11 30,30.96 | v32.7,35.56 v35.56,35.56 | v37.62,36.2 37.94,36.2 38.26,35.88 38.26,34.92 v39.05,34.13
  Bottom 0.203: v30.16,31.11 30.16,33.02 v32.7,35.56 | v35.56,35.56 36.99,35.56 v37.62,36.2 | v39.05,34.13 43.34,34.13 45.62,36.41 C15.1
N$19  (via drill 0.3)
  Top 0.152: 48.14,23.3 48.14,23.14 48.66,22.54 51.28,22.54 51.59,22.86 51.59,25.88 51.91,26.19 52.86,26.19 53.34,26.67 53.34,27.94 v53.66,28.26 | U$7.P$51 45.91,23.3
  Top 0.203: U$7.P$50 U$7.P$51 48.14,23.3 | v54.29,32.7 54.29,34.24 C10.2 | 41.27,38.1 41.27,30.48 44.93,26.83 44.93,24.13 45.76,23.3 45.91,23.3
  Top 0.254: v50.8,49.53 49.53,48.26 L1.2 | 41.27,38.1 40.64,38.73 40.64,42.55 v41.27,43.18 | 46.35,22.86 U$7.P$50
  Bottom 0.203: v53.66,28.26 53.66,32.07 v54.29,32.7
  Bottom 0.254: v50.8,49.53 50.8,47.62 | v41.27,43.18 46.35,43.18 50.8,47.62 | 50.8,47.62 D1.P$2
N$20  (via drill 0.3 pad 0.3)
  Top 0.203: U$7.P$2 38.2,25.3 37.62,25.88 34.61,25.88 33.97,26.51 32.7,26.51 32.07,25.88 30.8,25.88 30.32,26.35 30.32,27.15 v30.48,27.3 | v28.1,30 27.78,30 27.62,29.84 27.62,28.68 C6.1 27.94,28.16 R20.2
  Bottom 0.203: v30.48,27.3 30.48,27.62 30.32,27.78 28.73,27.78 28.57,27.94 28.57,29.53 v28.1,30
N$21
  Top 0.152: U$7.P$49 48.11,22.3 48.26,22.15 51.59,22.15 52.07,22.7 52.07,25.72 52.23,25.88 53.9,25.88 54.61,26.59 54.61,28.65 54.05,29.21 R19.2
N$22
  Top 0.203: U$7.P$33 48.88,14.3 51.44,11.75 51.44,9.84 51.75,9.53 55.88,9.53 56.2,9.84 56.2,11.33 C4.1 59.48,12.28 R10.1
N$23
  Top 0.203: U$7.P$32 48.43,13.8 50.8,11.43 50.8,9.21 51.12,8.89 55.56,8.89 56.2,8.26 56.52,8.26 57.15,8.89 C4.2 57.57,10.58 58.74,11.75 61.49,11.75 R11.1
N$24
  Top 0.203: U$7.P$31 48.3,13.3 50.16,11.43 50.16,9.21 51.12,8.26 55.24,8.26 56.2,7.3 57.05,7.3 C5.1 57.15,6.99 58.1,6.03 60.01,6.03 60.64,6.67 60.64,7.72 R12.1
N$26
  Top 0.203: U$7.P$38 49.88,16.8 52.07,14.61 54.61,14.61 55.88,15.88 55.88,16.83 56.36,17.3 56.46,17.3 C3.1
N$27
  Top 0.152: C16.1 38.52,11.33 37.78,12.06 37.78,12.38 38.1,12.7 39.33,12.7 U$7.P$27
N$28  (via drill 0.3 pad 0.3)
  Top 0.203: U$7.P$3 38.06,24.8 37.47,25.4 33.81,25.4 v33.34,25.88 | v35.88,45.88 36.35,45.4 36.35,44.45 32.86,40.96 v32.86,40.64 | v39.69,46.04 38.2,46.04 R24.1 | v33.34,27.15 33.34,28.1 v35.24,30
  Top 0.254: R24.1 R22.2
  Bottom 0.203: v33.34,25.88 v33.34,27.15 | v32.86,40.64 32.86,36.99 33.5,36.35 33.5,35.08 32.54,34.13 32.54,33.5 34.92,31.11 34.92,30.32 v35.24,30 | v35.88,45.88 35.88,46.04 36.51,46.67 39.05,46.67 v39.69,46.04
N$29  (via drill 0.3)
  Top 0.203: U$7.P$52 48.27,23.8 48.9,23.02 50.8,23.02 51.12,23.34 51.12,26.35 51.44,26.67 52.39,26.67 v52.7,26.99 | v52.7,32.38 52.7,34.02 C10.1
  Bottom 0.203: v52.7,26.99 v52.7,32.38
N$30  (via drill 0.3)
  Top 0.203: U$7.P$23 37.66,14.8 36.83,13.97 v33.02,13.97
  Bottom 0.203: v33.02,13.97 31.33,13.97 C18.1 C17.1
N$124  (via drill 0.3 pad 0.3)
  Top 0.203: R12.2 60.33,9.92 61.12,10.72 73.1,10.72 v73.66,10.16 | v64.77,68.58 64.77,65.42 U$9.P$3
  Bottom 0.203: v73.66,10.16 105.41,10.16 106.68,11.43 106.68,73.66 105.41,74.93 71.12,74.93 v64.77,68.58
N$126  (via drill 0.3 pad 0.3)
  Top 0.203: R10.2 60.33,15.88 v60.96,16.51 | v61.44,18.57 61.44,23 U$8.P$3
  Bottom 0.203: v60.96,16.51 61.44,16.99 v61.44,18.57
N$127  (via drill 0.3 pad 0.3)
  Top 0.203: R11.2 62.87,15.88 v62.23,16.51 | v62.63,18.49 62.63,20.95 61.83,21.75 v61.83,25.16 | v60.25,26.04 60.25,27.56 U$8.P$4
  Bottom 0.203: v62.23,16.51 62.23,18.1 v62.63,18.49 | v61.83,25.16 61.83,25.96 61.59,26.19 60.4,26.19 v60.25,26.04
N$128  (via drill 0.3 pad 0.3)
  Top 0.203: R13.2 72.81,9.74 v73.66,8.89 | v66.04,72.39 66.04,67.96 U$9.P$4
  Bottom 0.203: v73.66,8.89 106.68,8.89 107.95,10.16 107.95,73.66 105.97,75.64 69.29,75.64 v66.04,72.39
OCTW  (via drill 0.3 pad 0.3)
  Top 0.203: U$7.P$5 37.64,23.8 37.15,24.29 33.66,24.29 v33.34,23.97
  Top 0.406: v22.86,27.3 20.95,27.3 CTRL.3
  Bottom 0.203: R14.1 28.63,23.81 33.18,23.81 v33.34,23.97
  Bottom 0.406: R14.1 26.25,26.45 25.56,27.15 23.02,27.15 v22.86,27.3
PWRGD  (via drill 0.3 pad 0.3)
  Top 0.203: U$7.P$4 37.77,24.3 37.15,24.92 33.5,24.92 33.02,25.4 31.11,25.4 v30.48,24.77
  Bottom 0.203: v30.48,24.77 29.21,24.77 26.35,27.62 26.35,28.31 R23.2
  Bottom 0.406: CTRL.1 25.4,30.48 26.19,29.69 26.19,28.47 R23.2
REF
  Top 0.203: U$7.P$24 37.8,14.3 30.64,7.14 30.64,3.97 CURR.3
SENS1
  Bottom 0.406: R26.2 14.24,49.8 12.7,48.26 SENS.3 15.51,44.18 R27.2
SENS2
  Bottom 0.406: R29.2 25.4,44.45 24.13,45.72 21.59,45.72 20.95,45.09 16.35,45.09 15.24,46.2 SENS.2 15.24,48.42 15.72,48.9 18.57,48.9 19.21,48.26 21.32,48.26 R28.2
SENS3
  Bottom 0.406: R30.2 25.4,46.99 | 25.4,46.99 SENS.1 | R31.2 27.94,44.45 25.4,46.99
SO1
  Top 0.203: U$7.P$25 37.93,13.8 33.02,8.89 CURR.2
SO2
  Top 0.152: CURR.1 35.56,10.79 38.1,13.34 39.4,13.34 U$7.P$26
TEMP
  Top 0.203: TEMP.2 50.16,5.71 51.12,5.71 54.93,1.91 64.45,1.91 67.63,5.08 70.48,5.08 70.8,4.76 70.8,3.91 C27.1
  Top 0.406: 70.7,1.37 R32.1
  Top 0.813: 70.7,1.37 C27.1 74.87,3.81 U$11.1
VCC  (via drill 0.3, 0.3 pad 0.3, 0.5)
  Top 0.203: v50.16,24.13 49.53,23.5 49.21,23.5 48.41,24.3 U$7.P$53 U$7.P$54 45.76,24.8 45.48,25.08 45.48,26.67 | 55.88,38.73 43.18,38.73 42.55,38.1 42.55,30.48 45.48,27.54 45.48,26.67 | C11.2 45.85,11.17 U$7.P$29 47.39,12.3 v48.26,11.43 | v69.85,66.04 71.12,66.04 | v46.04,26.59 45.56,26.59 45.48,26.67
  Top 0.406: 62.23,48.26 C24.2 v58.42,50.8
  Top 1.27: U$5.D1 72.38,66.04 | C23.2 59.82,34.16 55.88,38.1 55.88,38.73 55.88,45.72 58.42,48.26 62.23,48.26
  Bottom 0.203: v50.16,24.13 50.67,24.13 C20.2 52.07,20.32 55.88,16.51 57.28,16.51 C19.2 | v48.26,11.43 46.99,11.43 45.72,12.7 C22.2 | v61.12,61.59 65.41,61.59 v69.85,66.04 | C21.2 48.26,24.13 46.04,26.35 v46.04,26.59
  Bottom 0.254: C14.1 43.18,41.91 45.72,41.91 C13.1 45.72,42.55 48.9,42.55 50.8,44.45 C12.1 50.8,45.09 56.52,50.8 v58.42,50.8
  Bottom 0.406: C22.2 45.73,21.47 C21.2 | U$15.P$1 v58.42,50.8 | v55.72,61.59 v55.72,59.69 v55.72,57.78 | v61.12,61.59 v61.12,59.69 v61.12,57.78
  other vias: 58.42,59.69 58.42,61.59 58.42,57.78
  pour Top: 71.12,72.39 91.44,72.39 91.44,16.51 71.12,16.51 71.12,48.26 59.69,48.26 59.69,52.07 71.12,52.07
  pour Bottom: 54.61,62.23 54.61,57.15 61.59,57.23 61.59,62.31